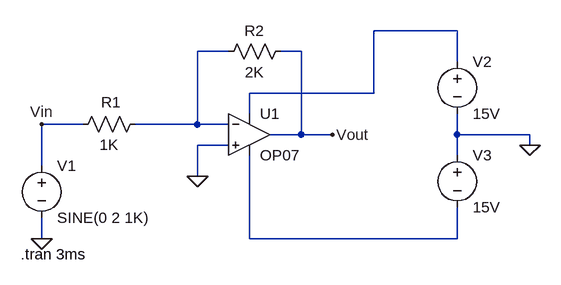
[diagram p0: schematic Inverting Amplifier.asc]
Inverting Amplifier.asc, the LTspice schematic file:
Version 4
SHEET 1 880 680
WIRE 544 -16 416 -16
WIRE 192 16 144 16
WIRE 304 16 272 16
WIRE 544 32 544 -16
WIRE 416 80 416 -16
WIRE 416 80 224 80
WIRE 224 112 224 80
WIRE -32 128 -96 128
WIRE 144 128 144 16
WIRE 144 128 48 128
WIRE 192 128 144 128
WIRE 304 144 304 16
WIRE 304 144 256 144
WIRE 352 144 304 144
WIRE 544 144 544 112
WIRE 656 144 544 144
WIRE 192 160 144 160
WIRE 656 160 656 144
WIRE 544 176 544 144
WIRE -96 192 -96 128
WIRE 144 208 144 160
WIRE -96 304 -96 272
WIRE 224 304 224 176
WIRE 544 304 544 256
WIRE 544 304 224 304
FLAG -96 304 0
FLAG 144 208 0
FLAG 656 160 0
FLAG -96 128 Vin
FLAG 352 144 Vout
SYMBOL OpAmps\\OP07 224 80 R0
SYMATTR InstName U1
SYMBOL res 64 112 R90
WINDOW 0 -2 53 VBottom 2
WINDOW 3 32 56 VTop 2
SYMATTR InstName R1
SYMATTR Value 1K
SYMBOL res 288 0 R90
WINDOW 0 0 56 VBottom 2
WINDOW 3 32 56 VTop 2
SYMATTR InstName R2
SYMATTR Value 2K
SYMBOL voltage -96 176 R0
WINDOW 123 0 0 Left 0
WINDOW 39 0 0 Left 0
SYMATTR InstName V1
SYMATTR Value SINE(0 2 1K)
SYMBOL voltage 544 16 R0
WINDOW 123 0 0 Left 0
WINDOW 39 0 0 Left 0
SYMATTR InstName V2
SYMATTR Value 15V
SYMBOL voltage 544 160 R0
SYMATTR InstName V3
SYMATTR Value 15V
TEXT -128 328 Left 2 !.tran 3ms

The netlist it stands for:
* Inverting Amplifier.asc
XU1 0 N002 N001 N003 Vout LT1001  ; OP07, pins In+ In- V+ V- OUT
R1 N002 Vin 1K
R2 Vout N002 2K
V1 Vin 0 SINE(0 2 1K)
V2 N001 0 15V
V3 0 N003 15V
.tran 3ms
.lib LTC.lib
.backanno
.end